# Altium schematic sheet 变压器电源.SchDoc
size A4
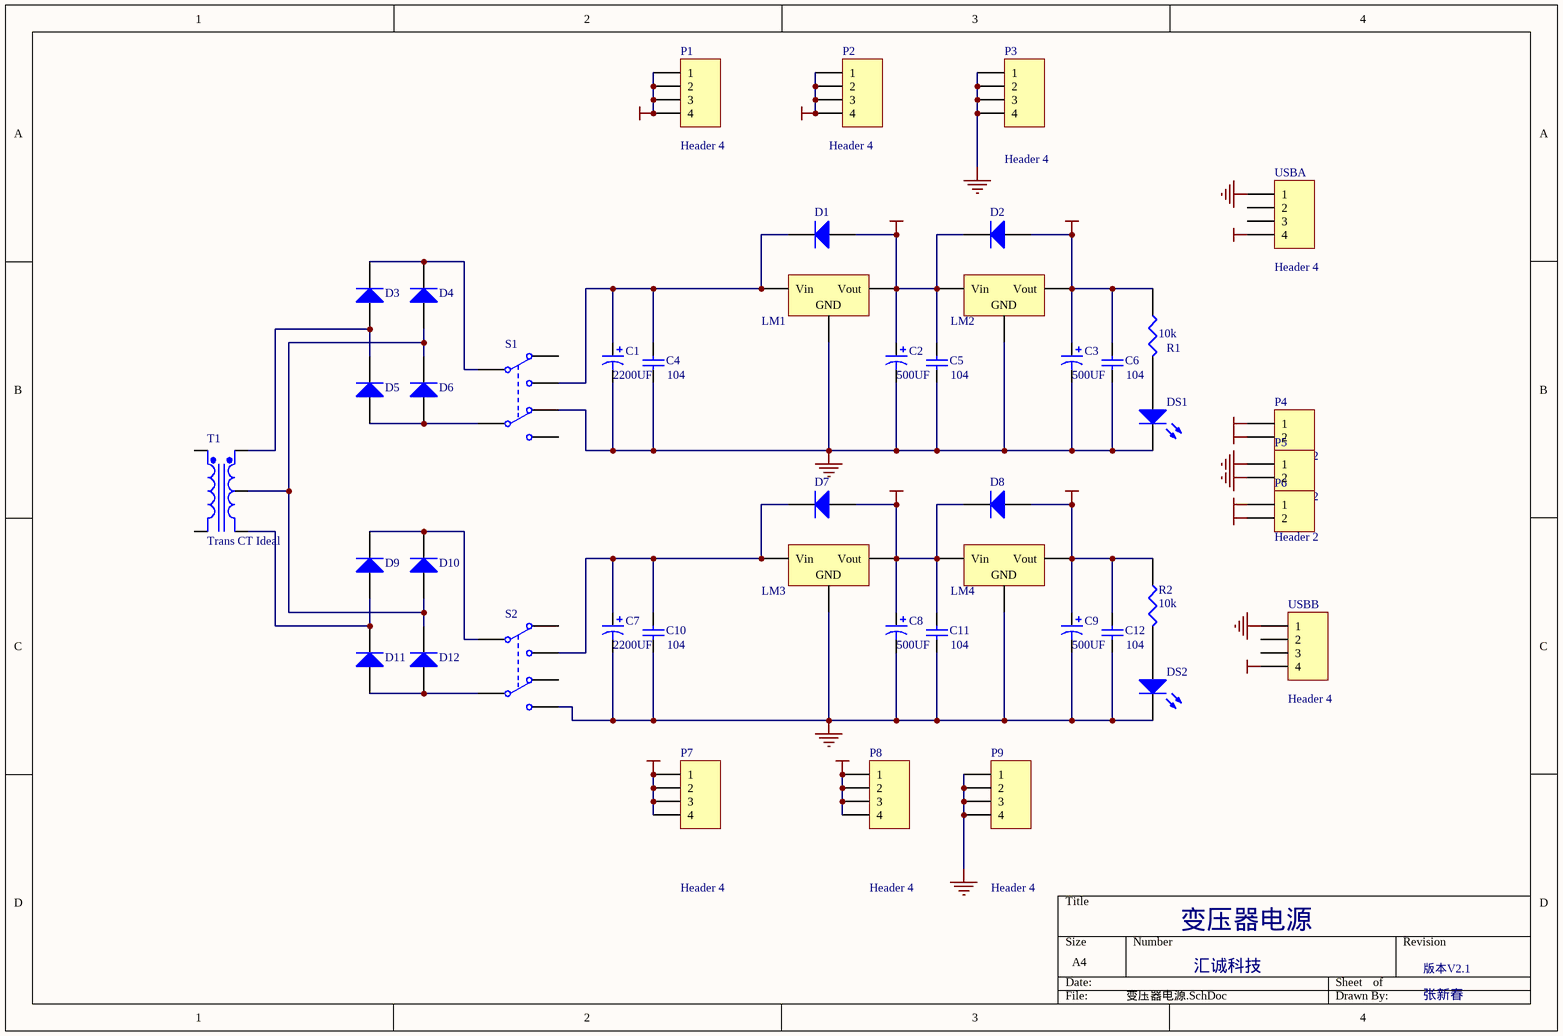
[diagram p0: 变压器电源.SchDoc]

## Parts
C1  value 2200UF  [C 2200/50]
C2  value 500UF  [C 220/50]
C3  value 500UF  [C 220/50]
C4  value 104  [HDR1X2]
C5  value 104  [HDR1X2]
C6  value 104  [HDR1X2]
C7  value 2200UF  [C 2200/50]
C8  value 500UF  [C 220/50]
C9  value 500UF  [C 220/50]
C10  value 104  [HDR1X2]
C11  value 104  [HDR1X2]
C12  value 104  [HDR1X2]
D1  (no value)  [DIO10.46-5.3x2.8]
D2  (no value)  [DIO10.46-5.3x2.8]
D3  (no value)  [DIO10.46-5.3x2.8]
D4  (no value)  [DIO10.46-5.3x2.8]
D5  (no value)  [DIO10.46-5.3x2.8]
D6  (no value)  [DIO10.46-5.3x2.8]
D7  (no value)  [DIO10.46-5.3x2.8]
D8  (no value)  [DIO10.46-5.3x2.8]
D9  (no value)  [DIO10.46-5.3x2.8]
D10  (no value)  [DIO10.46-5.3x2.8]
D11  (no value)  [DIO10.46-5.3x2.8]
D12  (no value)  [DIO10.46-5.3x2.8]
DS1  (no value)  [HDR1X2]
DS2  (no value)  [HDR1X2]
LM1  (no value)  [wyk]
LM2  (no value)  [wyk]
LM3  (no value)  [wyk]
LM4  (no value)  [wyk]
P1  Header 4  [HDR1X4]
P2  Header 4  [HDR1X4]
P3  Header 4  [HDR1X4]
P4  Header 2  [PCBComponent_1]
P5  Header 2  [PCBComponent_1]
P6  Header 2  [PCBComponent_1]
P7  Header 4  [HDR1X4]
P8  Header 4  [HDR1X4]
P9  Header 4  [HDR1X4]
R1  10k  [HDR1X2]
R2  10k  [HDR1X2]
S1  (no value)  [DPDT-6]
S2  (no value)  [DPDT-6]
T1  Trans CT Ideal  [T]
USBA  Header 4  [HDR1X4]
USBB  Header 4  [HDR1X4]

## Nets
A05: C3.1 C6.2 D2.1(A) LM2.3(Vout) P2.1 P2.2 P2.3 P2.4 P4.2 R1.1 USBA.4
A12: C2.1 C5.2 D1.1(A) D2.2(K) LM1.3(Vout) LM2.1(Vin) P1.1 P1.2 P1.3 P1.4 P4.1
AGND: C1.2 C2.2 C3.2 C4.1 C5.1 C6.1 DS1.2(K) LM1.2(GND) LM2.2(GND) P3.1 P3.2 P3.3 P3.4 P5.2 S1.4(NC2) USBB.1
B05: C9.1 C12.2 D8.1(A) LM4.3(Vout) P6.1 P8.1 P8.2 P8.3 P8.4 R2.1 USBB.4
B12: C8.1 C11.2 D7.1(A) D8.2(K) LM3.3(Vout) LM4.1(Vin) P6.2 P7.1 P7.2 P7.3 P7.4
BGND: C7.2 C8.2 C9.2 C10.1 C11.1 C12.1 DS2.2(K) LM3.2(GND) LM4.2(GND) P5.1 P9.1 P9.2 P9.3 P9.4 S2.6(NO2) USBA.1
NetC1_1: C1.1 C4.2 D1.2(K) LM1.1(Vin) S1.3(NO1)
NetC7_1: C7.1 C10.2 D7.2(K) LM3.1(Vin) S2.3(NO1)
NetD3_1: D3.1(A) D5.2(K) T1.3(Sec+)
NetD3_2: D3.2(K) D4.2(K) S1.1(COMMON1)
NetD4_1: D4.1(A) D6.2(K) D10.1(A) D12.2(K) T1.4(SecCT)
NetD5_1: D5.1(A) D6.1(A) S1.5(COMMON2)
NetD9_1: D9.1(A) D11.2(K) T1.5(Sec-)
NetD9_2: D9.2(K) D10.2(K) S2.1(COMMON1)
NetD11_1: D11.1(A) D12.1(A) S2.5(COMMON2)
NetDS1_1: DS1.1(A) R1.2
NetDS2_1: DS2.1(A) R2.2

Not connected (* = marked no-connect by the designer): S1 2(NC1) 6(NO2); S2 2(NC1) 4(NC2); T1 1(Pri+) 2(Pri-); USBA 2 3; USBB 2 3

## Notes on the sheet
- 变压器电源
- 汇诚科技
- 版本V2.1
- 张新春

## Library data of the parts
C1-C3 C7-C9 = Cap Pol1: Polarized Capacitor (Radial); Published: 8-Jun-2000; LatestRevisionDate: 17-Jul-2002; LatestRevisionNote: Re-released for DXP Platform.; Publisher: Altium Limited
C4-C6 C10-C12 = Cap: Capacitor; Published: 8-Jun-2000; LatestRevisionDate: 17-Jul-2002; LatestRevisionNote: Re-released for DXP Platform.; Publisher: Altium Limited
D1-D12 = Diode 1N4007: 1 Amp General Purpose Rectifier; Published: 8-Jun-2000; LatestRevisionDate: 17-Jul-2002; LatestRevisionNote: Re-released for DXP Platform.; DatasheetDocument: 1998; PackageDocument: Aug-1999; PackageReference: DO-41; Publisher: Altium Limited; Code_JEDEC: DO-204-AL
DS1 DS2 = LED0: Typical INFRARED GaAs LED; Published: 8-Jun-2000; LatestRevisionDate: 17-Jul-2002; LatestRevisionNote: Re-released for DXP Platform.; Publisher: Altium Limited
LM1-LM4 = Volt Reg: Voltage Regulator; Published: 24-Mar-1999; LatestRevisionDate: 17-Jul-2002; LatestRevisionNote: Re-released for DXP Platform.; Publisher: Altium Limited; Code_JEDEC: SMD-220
P1-P3 P7-P9 USBA USBB = Header 4: Header, 4-Pin; LatestRevisionDate: 17-Jul-2002; LatestRevisionNote: Re-released for DXP Platform.; Publisher: Altium Limited
P4-P6 = Header 2: Header, 2-Pin; LatestRevisionDate: 17-Jul-2002; LatestRevisionNote: Re-released for DXP Platform.; Publisher: Altium Limited
R1 R2 = RES1
S1 S2 = SW DPDT: Switch; Published: 24-Mar-1999; LatestRevisionDate: 17-Jul-2002; LatestRevisionNote: Re-released for DXP Platform.; Publisher: Altium Limited
T1 = Trans CT Ideal: Center-Tapped Transformer (Ideal); Published: 8-Jun-2000; LatestRevisionDate: 17-Jul-2002; LatestRevisionNote: Re-released for DXP Platform.; Publisher: Altium Limited